# EAGLE design NXTMotorControl2 (EAGLE 7.2.0)
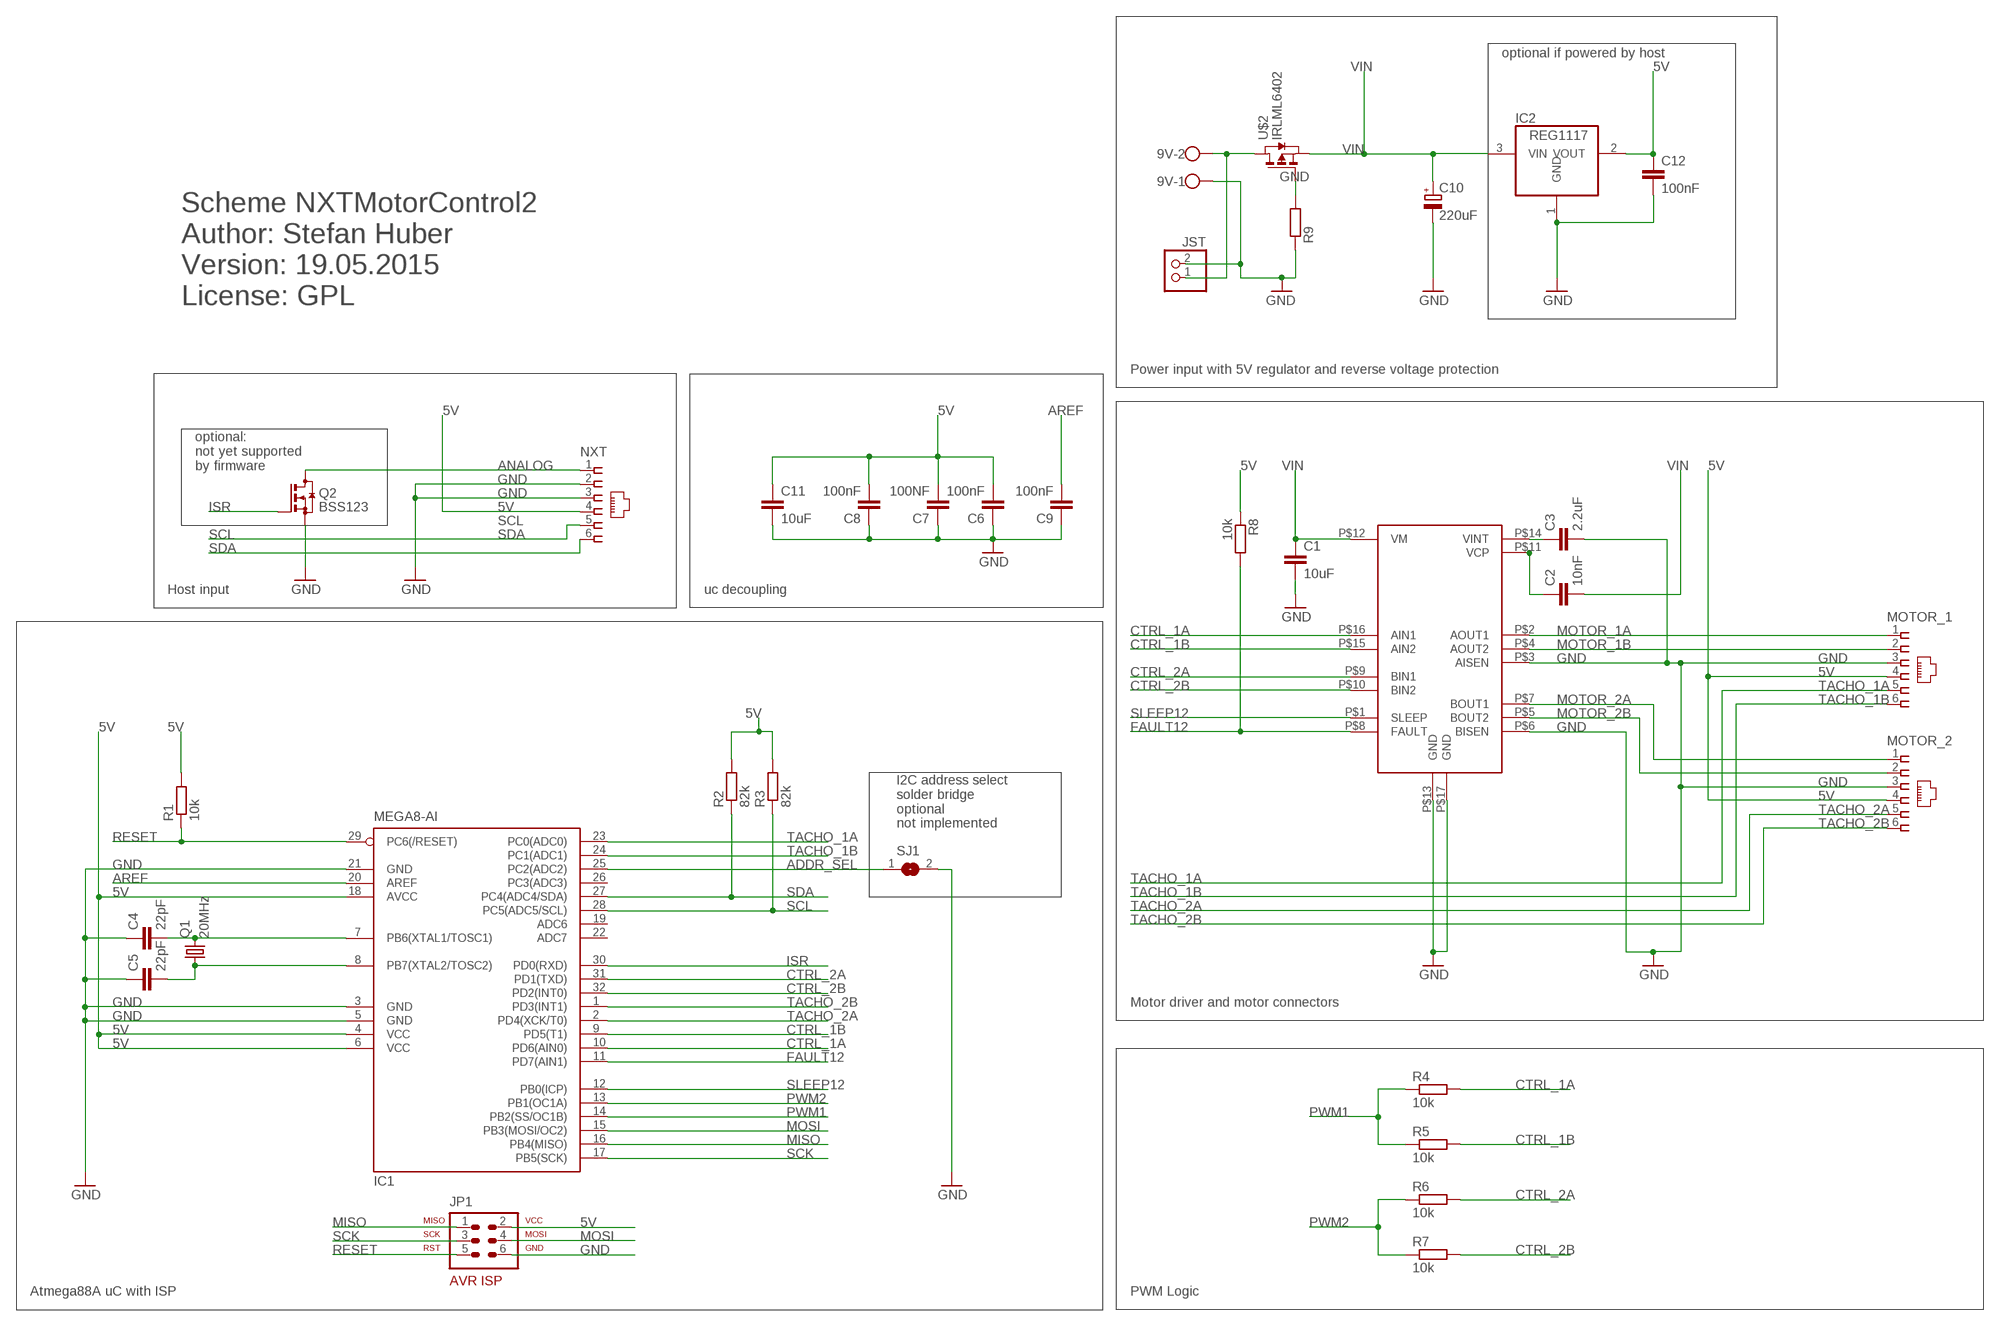
[diagram p0: schematic, sheet 1]

## Parts
9V  W237-102  [W237-102]
C1  10uF  C-EUC0805  [C0805]
C2  10nF  C-EUC0805  [C0805]
C3  2.2uF  C-EUC0805  [C0805]
C4  22pF  C-EUC0805  [C0805]
C5  22pF  C-EUC0805  [C0805]
C6  100nF  C-EUC0805  [C0805]
C7  100NF  C-EUC0805  [C0805]
C8  100nF  C-EUC0805  [C0805]
C9  100nF  C-EUC0805  [C0805]
C10  220uF  CPOL-EUE3.5-8  [E3,5-8]
C11  10uF  C-EUC0805  [C0805]
C12  100nF  C-EUC0805  [C0805]
IC1  MEGA8-AI  [TQFP32-08]
IC2  REG1117  [SOT223]
JP1  ISP  AVR-ISP-6VERT  [AVR-ISP-6]
JST  JST_2PIN-THM  [JST-PH-2-THM]
MOTOR_1  NXT  [NXT]
MOTOR_2  NXT  [NXT]
NXT  NXT  [NXT]
Q1  20MHz  CRYSTALHC49S  [HC49/S]
Q2  BSS123  [SOT23]
R1  10k  R-EU_R0805  [R0805]
R2  82k  R-EU_R0805  [R0805]
R3  82k  R-EU_R0805  [R0805]
R4  10k  R-EU_R0805  [R0805]
R5  10k  R-EU_R0805  [R0805]
R6  10k  R-EU_R0805  [R0805]
R7  10k  R-EU_R0805  [R0805]
R8  10k  R-EU_R0805  [R0805]
R9  R-EU_R0805  [R0805]
SJ1  SJ  [SJ]
U$1  DRV8833  [HTSSOP16]
U$2  IRLML6402  [SOT-23]

## Nets
5V: C6.2 C7.2 C8.2 C11.1 C12.1 IC1.4(VCC) IC1.6(VCC) IC1.18(AVCC) IC2.2(VOUT) JP1.2 MOTOR_1.4 MOTOR_2.4 NXT.4 R1.2 R2.2 R3.2 R8.1
ADDR_SEL: IC1.25(PC2(ADC2)) SJ1.1
ANALOG: NXT.1 Q2.3(D)
AREF: C9.2 IC1.20(AREF)
CTRL_1A: IC1.10(PD6(AIN0)) R4.2 U$1.P$16(AIN1)
CTRL_1B: IC1.9(PD5(T1)) R5.2 U$1.P$15(AIN2)
CTRL_2A: IC1.31(PD1(TXD)) R6.2 U$1.P$9(BIN1)
CTRL_2B: IC1.32(PD2(INT0)) R7.2 U$1.P$10(BIN2)
FAULT12: IC1.11(PD7(AIN1)) R8.2 U$1.P$8(FAULT)
GND: 9V.1 C1.2 C3.2 C4.1 C5.1 C6.1 C7.1 C8.1 C9.1 C10.- C11.2 C12.2 IC1.3(GND) IC1.5(GND) IC1.21(GND) IC2.1(GND) JP1.6 JST.2 MOTOR_1.3 MOTOR_2.3 NXT.2 NXT.3 Q2.2(S) R9.1 SJ1.2 U$1.P$3(AISEN) U$1.P$6(BISEN) U$1.P$13(GND) U$1.P$17(GND)
ISR: IC1.30(PD0(RXD)) Q2.1(G)
MISO: IC1.16(PB4(MISO)) JP1.1
MOSI: IC1.15(PB3(MOSI/OC2)) JP1.4
MOTOR_1A: MOTOR_1.1 U$1.P$2(AOUT1)
MOTOR_1B: MOTOR_1.2 U$1.P$4(AOUT2)
MOTOR_2A: MOTOR_2.1 U$1.P$7(BOUT1)
MOTOR_2B: MOTOR_2.2 U$1.P$5(BOUT2)
N$1: C4.2 IC1.7(PB6(XTAL1/TOSC1)) Q1.2
N$2: C3.1 U$1.P$14(VINT)
N$3: C2.1 U$1.P$11(VCP)
N$4: C5.2 IC1.8(PB7(XTAL2/TOSC2)) Q1.1
N$6: 9V.2 JST.1 U$2.3(D)
N$7: R9.2 U$2.1(G)
PWM1: IC1.14(PB2(SS/OC1B)) R4.1 R5.1
PWM2: IC1.13(PB1(OC1A)) R6.1 R7.1
RESET: IC1.29(PC6(/RESET)) JP1.5 R1.1
SCK: IC1.17(PB5(SCK)) JP1.3
SCL: IC1.28(PC5(ADC5/SCL)) NXT.5 R3.1
SDA: IC1.27(PC4(ADC4/SDA)) NXT.6 R2.1
SLEEP12: IC1.12(PB0(ICP)) U$1.P$1(SLEEP)
TACHO_1A: IC1.23(PC0(ADC0)) MOTOR_1.5
TACHO_1B: IC1.24(PC1(ADC1)) MOTOR_1.6
TACHO_2A: IC1.2(PD4(XCK/T0)) MOTOR_2.5
TACHO_2B: IC1.1(PD3(INT1)) MOTOR_2.6
VIN: C1.1 C2.2 C10.+ IC2.3(VIN) U$1.P$12(VM) U$2.2(S)
Unconnected: IC1.19(ADC6) IC1.22(ADC7) IC1.26(PC3(ADC3))

## Notes on the sheet
- optional if powered by host
- Scheme NXTMotorControl2
  Author: Stefan Huber
  Version: 19.05.2015
  License: GPL
- Power input with 5V regulator and reverse voltage protection
- optional:
  not yet supported
  by firmware
- Host input | uc decoupling
- I2C address select
  solder bridge
  optional
  not implemented
- Motor driver and motor connectors
- Atmega88A uC with ISP | PWM Logic

## Library data of the parts
9V = con-wago-500:W237-102: WAGO SCREW CLAMP; MPN: 237-102; OC_FARNELL: unknown; OC_NEWARK: 70K9898
C1-C3 C12 = rcl:C-EU: CAPACITOR, European symbol
C4-C9 C11 = resistor:C-EU: CAPACITOR, European symbol
C10 = rcl:CPOL-EU: POLARIZED CAPACITOR, European symbol
IC1 = atmel:MEGA8: MICROCONTROLLER 8 Kbytes FLASH, 1 kbytes SRAM, 512 bytes EEPROM, USART, 6-channel 10 bit ADC, 2-channel 8 bit ADC Pin compatible with Atmega48, ATMega88, ATMega168 Source: avr.lbr; MPN: ATMEGA8-16AU; OC_FARNELL: 9171371; OC_NEWARK: 73M8863
IC2 = burr-brown:REG1117: 800mA and 1A Low Dropout (LDO) Positive Regulator 1.8V, 2.5V, 2.85V, 3.3V, 5V, and Adj; MPN: REG1117; OC_FARNELL: 1097566; OC_NEWARK: 14P6981
JP1 = avr-7:AVR-ISP-6: AVR ISP-6 Serial Programming Header
JST = adafruit:JST_2PIN: JST 2-Pin Connectors of various flavors SMT-RA (S2B-PH-SM4) 4UConnector #17311 SMT (B2B-PH-SM4) THM-RA (S2B-PH) THM (B2B-PH)
MOTOR_1 MOTOR_2 NXT = NXT:NXT: 6 Pin RJ-12 Connector for Lego Mindstorms NXT 6/6 Western Telephone Jack
Q1 = crystal:CRYSTAL: CRYSTAL; OC_FARNELL: 1667008; OC_NEWARK: unknown
Q2 = transistor-small-signal:BSS123: N-CHANNEL MOS FET
R1-R9 = rcl:R-EU_: RESISTOR, European symbol
SJ1 = jumper:SJ: SMD solder JUMPER
U$1 = drv8833:DRV8833
U$2 = IRLML6402:IRLML6402

## Board
- 07.03.2015 Removed reverse voltage protection diode; added JST Power connector; removed one of the uC setting solder pads (hidden by NXT connector) - 11.03.2015 Added mosefet reverse voltate protection
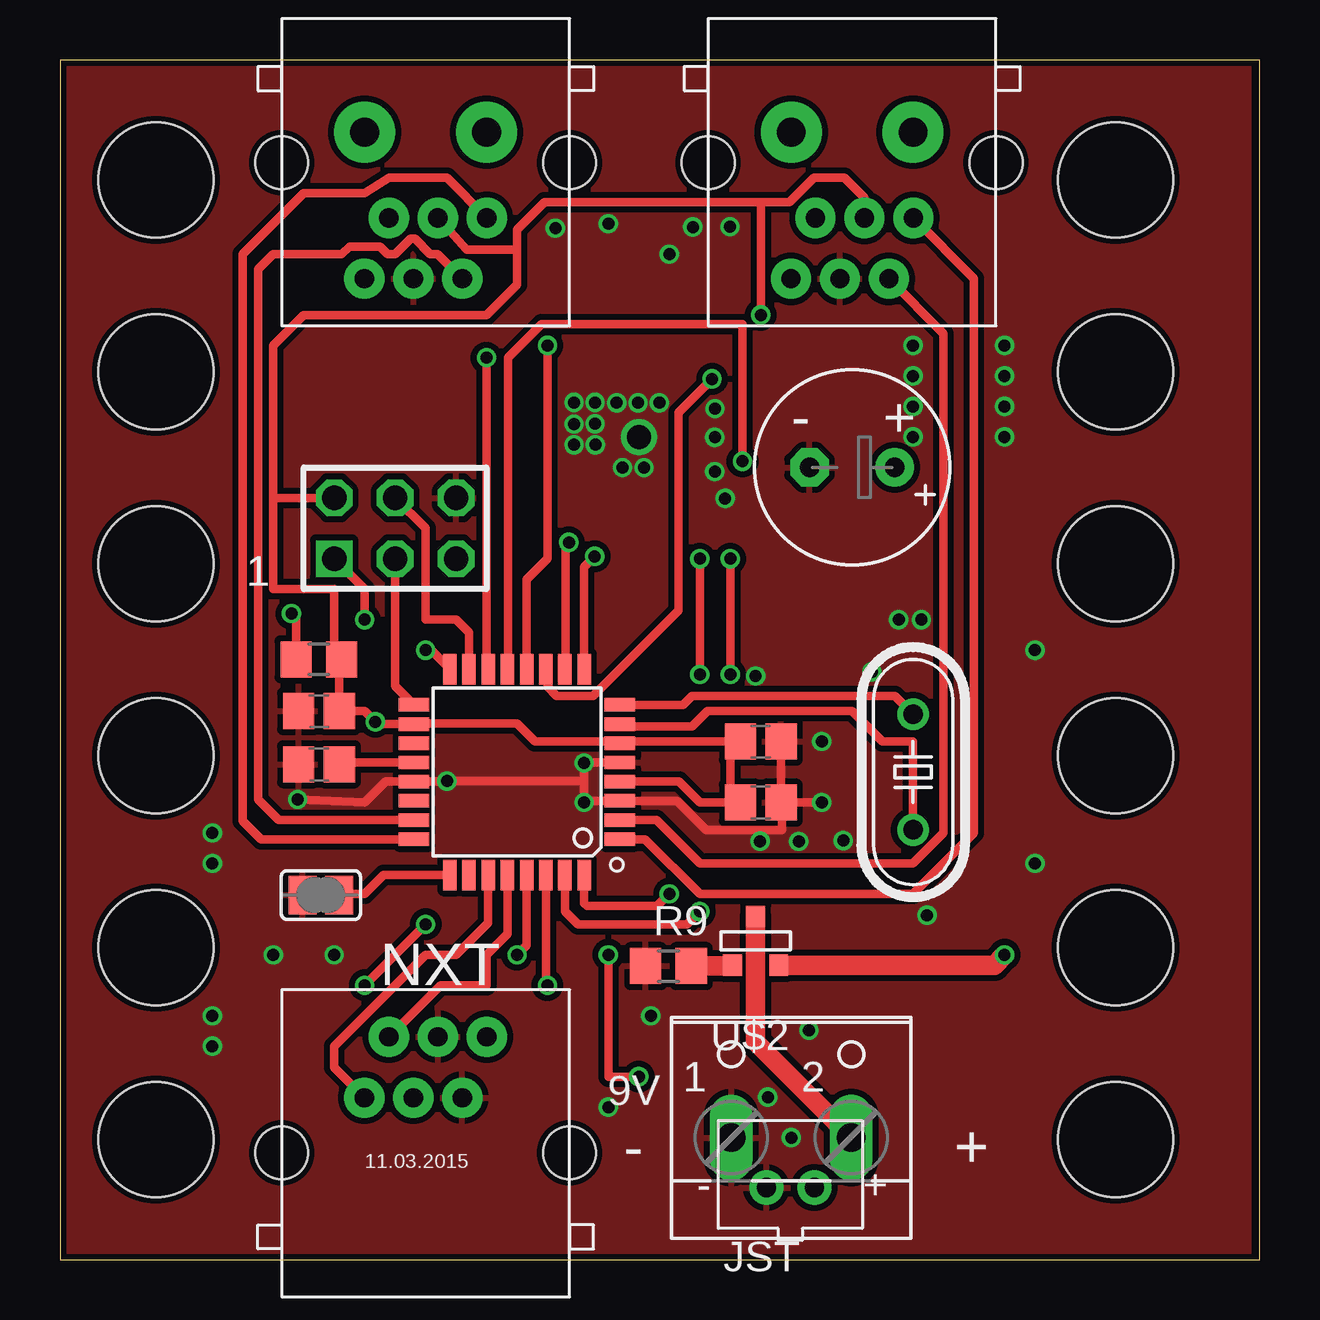
[diagram p1: board, top side]
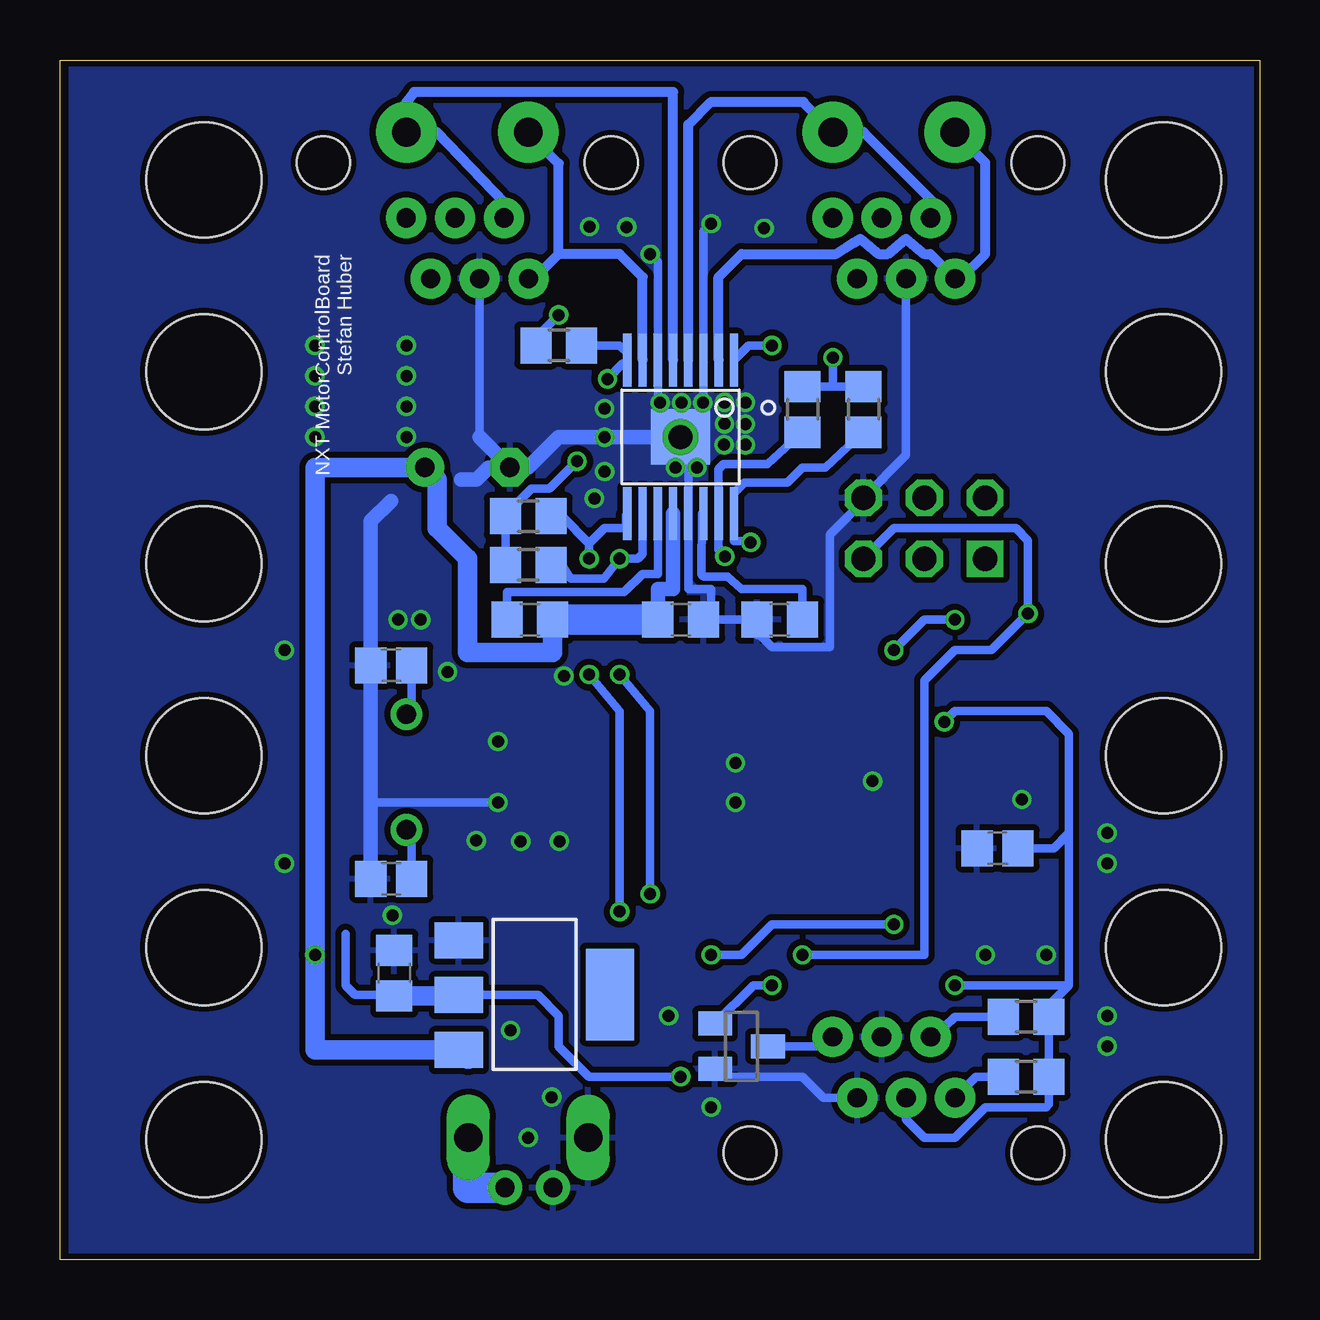
[diagram p2: board, bottom side, seen from below]

Size 50 x 50 mm. Coordinates in mm from the lower left corner, seen from the top.
Outline: 0,0 50,0 50,50 0,50 0,0
Copper layers (1*16): Top 0.035mm / dielectric 1.5mm / Bottom 0.035mm
Design rules "ITEADstudio_DRC": minimum track width 6mil, minimum drill 12mil, track to track 6mil, track to pad 6mil, pad to pad 6mil, via to via 6mil, smd to smd 0mil, copper to edge 10mil, drill to drill 10mil, minimum pad ring 10mil, minimum via ring 6mil, stop-mask expansion 2mil, vias tented up to drill 100mil, thermal gap 10mil
Holes 4.8 mm at 4,5 4,13 4,21 4,29 4,37 4,45 44,45 44,5 44,13 44,21 44,29 44,37

### Footprints (pad centres in the part's own frame; a part is rotated, then mirrored left to right if it is on the bottom)
W237-102 = drill 1.194 long: 1 -2.5,-1.27; 2 2.5,-1.27
C0805 = smd 1.3 x 1.5: 1 -0.95,0; 2 0.95,0
C0805' = smd 1.3 x 1.5: 1 -0.85,0; 2 0.85,0
E3,5-8 = drill 0.813 pad 1.6: + -1.778,0 | drill 0.813 pad 1.6 octagon: - 1.778,0
TQFP32-08 = smd 1.27 x 0.559: 1 -4.293,2.8; 2 -4.293,2; 3 -4.293,1.2; 4 -4.293,0.4; 5 -4.293,-0.4; 6 -4.293,-1.2; 7 -4.293,-2; 8 -4.293,-2.8; 17 4.293,-2.8; 18 4.293,-2; 19 4.293,-1.2; 20 4.293,-0.4; 21 4.293,0.4; 22 4.293,1.2; 23 4.293,2; 24 4.293,2.8 | smd 0.559 x 1.27: 9 -2.8,-4.293; 10 -2,-4.293; 11 -1.2,-4.293; 12 -0.4,-4.293; 13 0.4,-4.293; 14 1.2,-4.293; 15 2,-4.293; 16 2.8,-4.293; 25 2.8,4.293; 26 2,4.293; 27 1.2,4.293; 28 0.4,4.293; 29 -0.4,4.293; 30 -1.2,4.293; 31 -2,4.293; 32 -2.8,4.293
SOT223 = smd 1.499 x 2.007: 1 -2.261,-3.15; 2 0.025,-3.15; 3 2.311,-3.15 | smd 3.81 x 2.007: 4 0,3.15
AVR-ISP-6 = drill 1.016 square: 1 -2.54,-1.27 | drill 1.016 octagon: 2 -2.54,1.27; 3 0,-1.27; 4 0,1.27; 5 2.54,-1.27; 6 2.54,1.27
JST-PH-2-THM = drill 0.8 pad 1.422: 1 1,0; 2 -1,0
NXT = drill 0.8 pad 1.676: 1 2.55,4.84; 2 1.53,2.3; 3 0.51,4.84; 4 -0.51,2.3; 5 -1.53,4.84; 6 -2.55,2.3 | hole 2.2: -6,0; 6,0
HC49/S = drill 0.813: 1 -2.413,0; 2 2.413,0
SOT23 = smd 1 x 1.4: 1 -0.95,-1.1; 2 0.95,-1.1; 3 0,1.1
R0805 = smd 1.3 x 1.5: 1 -0.95,0; 2 0.95,0
SJ = smd 1.168 x 1.6: 1 -0.762,0; 2 0.762,0
HTSSOP16 = smd 0.35 x 2.2: P$1 -2.223,-3.2; P$2 -1.587,-3.2; P$3 -0.953,-3.2; P$4 -0.318,-3.2; P$5 0.318,-3.2; P$6 0.953,-3.2; P$7 1.587,-3.2; P$8 2.223,-3.2; P$9 2.223,3.2; P$10 1.587,3.2; P$11 0.953,3.2; P$12 0.318,3.2; P$13 -0.318,3.2; P$14 -0.953,3.2; P$15 -1.587,3.2; P$16 -2.223,3.2 | smd 2.46 x 2.31: P$17 0,0
SOT-23 = smd 0.787 x 0.889: 1 0.991,1.016; 2 -0.94,1.016; 3 0.025,-1.016

### Placement (x,y rotation side)
9V  30.48,6.35 0 top
C1  24.13,26.67 0 bottom
C2  30.42,26.67 0 bottom
C3  20,26.67 180 bottom
C4  22pF  [C0805']  36.2,15.88 0 bottom
C5  22pF  [C0805']  36.2,24.77 0 bottom
C6  100nF  [C0805']  10.79,22.86 0 top
C7  100NF  [C0805']  29.21,19.05 180 top
C8  100nF  [C0805']  29.21,21.59 180 top
C9  100nF  [C0805']  10.79,20.64 0 top
C10  33.02,33.02 180 top
C11  10uF  [C0805']  10.92,17.14 180 bottom
C12  36.07,11.94 90 bottom
IC1  19.05,20.32 180 top
IC2  30.23,11.05 270 bottom
JP1  13.97,30.48 0 top
JST  30.44,3 0 top
MOTOR_1  15.24,45.72 180 top
MOTOR_2  33.02,45.72 180 top
NXT  15.24,4.45 0 top
Q1  35.56,20.32 270 top
Q2  21.59,8.89 270 bottom
R1  10.79,25.02 0 top
R2  9.73,7.62 0 bottom
R3  9.73,10.12 0 bottom
R4  16.51,35.43 270 bottom
R5  19.05,35.43 270 bottom
R6  30.48,30.99 0 bottom
R7  30.48,28.96 0 bottom
R8  29.21,38.1 0 bottom
R9  25.36,12.23 0 top
SJ1  10.87,15.19 180 top
U$1  24.13,34.29 180 bottom
U$2  29.02,13.28 180 top

### Tracks (layer width: path | path; a pad name or v marks a point on that pad's centre or on a via)
5V  (via drill 0.5)
  Top 0.35: 27.94,19.05 C7.2 | MOTOR_2.4 33.53,44.26 32.7,45.09 31.43,45.09 30.42,44.07 29.21,44.07 | 19.05,42.1 16.94,42.1 MOTOR_1.4 | 8.89,31.75 8.89,27.94 11.43,27.94 11.43,25.33 R1.2 11.64,24.92 C6.2 12.7,22.86 v13.14,22.42 13.24,22.32 IC1.18 14.79,22.35 19.05,22.35 19.81,21.59 23.27,21.59 IC1.6 23.41,21.59 C8.2 27.94,21.17 27.94,19.05 | 8.89,31.75 8.89,38.1 10.16,39.37 17.78,39.37 19.05,40.64 19.05,42.1 | JP1.2 8.89,31.75 | IC1.4 25.8,19.92 26.67,19.05 27.94,19.05 | 19.05,42.1 19.05,42.93 20.19,44.07 29.21,44.07 | v29.21,39.37 29.21,44.07 | v15.24,13.97 v12.7,11.43 | v24.13,7.62 22.86,7.62 v22.86,12.7
  Bottom 0.35: NXT.4 14.73,5.84 13.97,5.08 12.7,5.08 11.43,6.35 8.89,6.35 8.78,6.46 R2.2 R3.2 8.64,10.73 7.94,11.43 | 7.94,11.43 7.94,17.78 | 7.94,17.78 7.94,21.91 8.89,22.86 12.7,22.86 v13.14,22.42 | R8.1 30.16,38.42 v29.21,39.37 | C11.1 8.57,17.14 7.94,17.78 | v22.86,12.7 21.59,12.7 20.32,13.97 v15.24,13.97 | v12.7,11.43 7.94,11.43 | 38.09,13.56 38.1,13.55 38.1,11.43 37.69,11.02 IC2.2 30.07,11.02 29.21,10.16 29.21,8.89 27.94,7.62 v24.13,7.62
  Bottom 0.813: C12.1 33.41,10.99 IC2.2
ADDR_SEL
  Top 0.35: IC1.25 13.49,16.03 12.7,15.24 11.68,15.24 SJ1.1
ANALOG
  Bottom 0.35: Q2.3 18.18,8.89 NXT.1
AREF
  Top 0.35: IC1.20 11.73,20.72 C9.2
CTRL_1A  (via drill 0.5)
  Top 0.35: IC1.10 21.08,24.64 21.08,29.77 v21.21,29.9
  Bottom 0.35: R4.2 18.1,33.02 19.05,33.02 19.68,32.38 21.46,32.38 21.91,31.94 U$1.P$16 21.91,29.95 21.26,29.95 v21.21,29.9
CTRL_1B  (via drill 0.5)
  Top 0.35: IC1.9 21.85,28.87 v22.29,29.31
  Bottom 0.35: R5.2 20.51,33.15 22.35,33.15 22.54,32.96 U$1.P$15 22.54,29.57 v22.29,29.31
CTRL_2A  (via drill 0.5)
  Top 0.35: IC1.31 21.05,14.51 21.59,13.97 26.14,13.97 v26.67,14.5 | v27.94,24.38 v27.94,29.21
  Bottom 0.35: v26.67,14.5 26.67,22.86 v27.94,24.38 | v27.94,29.21 27.94,29.84 | 27.94,29.84 27.3,30.48 26.42,30.48 26.42,31.03 U$1.P$9 | R6.2 29.08,30.99 27.94,29.84
CTRL_2B  (via drill 0.5)
  Top 0.35: v26.67,24.38 v26.67,29.21 | IC1.32 21.85,14.85 21.97,14.73 24.89,14.73 v25.4,15.24
  Bottom 0.35: v25.4,15.24 25.4,22.86 v26.67,24.38 | U$1.P$10 25.72,29.4 25.91,29.21 v26.67,29.21 27.33,28.38 28.73,28.38 29.08,28.96 R7.2
FAULT12  (via drill 0.5)
  Top 0.35: v27.18,36.7 25.78,35.31 25.78,27.05 22.23,23.5 20.7,23.5 20.32,23.88 20.32,24.51 IC1.11
  Bottom 0.35: R8.2 26.67,38.1 26.35,37.78 U$1.P$8 26.42,37.34 26.54,37.34 v27.18,36.7
GND  (via drill 0.5, 1)
  Top 0.35: C8.1 C7.1 | v9.91,19.18 12.7,19.05 13.57,19.92 IC1.21 16.11,19.92 v16.13,19.94 21.84,19.94 | C7.1 v31.75,19.05 | IC1.5 21.86,20.72 v21.84,20.7 21.84,19.94 | C7.1 30.1,19.01 30.1,17.91 26.92,17.91 25.71,19.12 IC1.3 22.16,19.12 v21.84,19.05 21.84,19.94 | 10.1,15.18 SJ1.2
  Bottom 0.35: U$1.P$17 25.08,35.24 U$1.P$6 25.08,41.59 v25.4,41.91 | C3.2 C1.2 22.86,26.99 22.86,27.94 23.81,27.94 U$1.P$13 23.81,33.97 U$1.P$17 | U$1.P$17 23.18,35.24 U$1.P$3 23.18,42.86 v22.86,43.18 | MOTOR_2.3 32.51,34.29 | NXT.2 18.18,6.75 19.05,7.62 22.37,7.62 Q2.2 | v31.75,19.05 37.05,19.05 | C3.2 20.95,26.03 | MOTOR_1.3 14.73,40.77 14.73,33.53 JP1.6 16.51,31.62 17.91,30.23 17.91,25.53 20.32,25.53 20.83,26.04 C3.2
  Bottom 0.61: C4.1 37.05,19.05 C5.1 37.05,30.77 36.2,31.62 | 32.51,34.29 C10.- | U$1.P$17 29.21,34.29 30.48,33.02 C10.- | 33.27,32.51 32.64,32.51 32.13,33.02 C10.-
  other vias: 24.13,34.29 35.9,26.67 36.14,14.35 31.75,21.59 22.86,6.35 40.64,16.51 40.64,25.4 39.37,35.56 39.37,36.83 27.3,35.47 35.56,36.83 35.56,35.56 27.29,34.28 27.29,32.84 22.31,33.96 21.42,33.96 28.99,24.32 33.85,24.5 34.96,26.67 29.18,17.44 30.8,17.42 32.65,17.46 6.35,17.78 6.35,16.51 6.35,10.16 6.35,8.89 22.3,35.73 22.3,34.84 21.42,34.82 21.42,35.73 23.2,35.71 24.09,35.71 24.98,35.71 23.44,33.01 24.35,33.01 11.43,12.7 8.89,12.7 39.37,34.29 35.56,34.29 35.56,38.1 39.37,38.1 27.72,31.72 27.93,43.05 26.38,43.04 20.65,42.99 30.48,5.08 24.63,10.16 31.22,9.55 29.5,6.77
  pour Top (isolate 0.254): 0,50.8 49.53,50.8 49.53,0 0,0
  pour Bottom (isolate 0.254): 0,50.8 49.53,50.8 49.53,0 0,0
ISR  (via drill 0.5)
  Top 0.35: IC1.30 20.25,11.5 v20.32,11.43
  Bottom 0.35: v20.32,11.43 21.1,11.43 Q2.1
MISO  (via drill 0.5)
  Top 0.35: JP1.1 12.7,27.94 v12.7,26.67 | v15.24,25.4 15.46,25.4 IC1.16
  Bottom 0.35: v12.7,26.67 13.97,26.67 v15.24,25.4
MOSI
  Top 0.35: JP1.4 15.24,30.48 15.24,26.67 16.51,26.67 17.05,26.13 IC1.15
MOTOR_1A  (via drill 1.2 pad 2.54)
  Bottom 0.35: MOTOR_1.1 12.46,40.88
  Bottom 0.406: 12.46,40.88 11.43,41.91 11.43,45.72 v12.7,46.99 | U$1.P$2 22.54,40.96 21.59,41.91 17.65,41.91 16.94,42.37 16.64,42.55 15.88,41.91 15.49,41.91 14.73,42.55 13.97,41.91 13.72,41.91 MOTOR_1.1
MOTOR_1B  (via drill 1.2 pad 2.54)
  Bottom 0.35: 13.34,43.81 13.34,43.8 | 19.01,48.26 19.01,48.22
  Bottom 0.406: 13.34,43.81 16.51,46.99 v17.78,46.99 19.01,48.22 | 13.34,43.8 MOTOR_1.2 | U$1.P$4 23.81,47.31 22.86,48.26 19.01,48.26
MOTOR_2A  (via drill 1.2 pad 2.54)
  Bottom 0.406: MOTOR_2.1 30.24,40.88 29.21,41.91 | 29.21,41.91 29.21,45.68 30.48,46.95 v30.48,46.99 | U$1.P$7 25.72,40.96 26.67,41.91 29.21,41.91
MOTOR_2B  (via drill 1.2 pad 2.54)
  Bottom 0.406: MOTOR_2.2 31.47,43.78 31.47,44.06 34.29,46.99 v35.56,46.99 35.56,48.26 35.24,48.67 24.45,48.67 U$1.P$5
N$1
  Top 0.35: IC1.7 23.44,22.23 26.35,22.23 26.99,22.86 33.02,22.86 34.29,21.59 35.56,21.59 Q1.2
  Bottom 0.35: C4.2 35.34,17.69 Q1.2
N$2
  Bottom 0.35: C3.1 19.05,27.94 21.59,27.94 22.19,28.47 23.15,28.47 arc90 23.25,28.57 23.24,31.09 U$1.P$14
N$3
  Bottom 0.35: U$1.P$11 25.08,28.57 25.72,28.57 26.48,27.81 31.37,27.81 C2.1
N$4
  Top 0.35: 35.17,23.12 Q1.1 34.8,23.5 26.35,23.5 25.98,23.12 IC1.8
  Bottom 0.35: C5.2 35.34,22.95 Q1.1
N$6
  Top 0.813: U$2.3 28.99,9.07 9V.2 32.83,5.08
  Bottom 1.27: JST.1 32.98,3 9V.2
N$7
  Top 0.813: R9.2 28,12.24 U$2.1
PWM1  (via drill 0.5)
  Top 0.35: v17.78,37.59 17.78,24.64 IC1.14
  Bottom 0.35: R5.1 17.78,36.38 | 17.78,36.38 R4.1 | 17.78,36.38 v17.78,37.59
PWM2  (via drill 0.5)
  Top 0.35: v28.45,33.27 28.45,38.99 20.07,38.99 18.67,37.59 18.67,24.64 IC1.13
  Bottom 0.35: R7.1 R6.1 31.37,31.11 30.35,32.13 29.59,32.13 v28.45,33.27
RESET  (via drill 0.5)
  Top 0.35: R1.1 9.85,26.73 v9.65,26.92 | IC1.29 19.45,13.1 v19.05,12.7
  Bottom 0.35: JP1.5 15.24,30.48 10.16,30.48 9.65,29.97 v9.65,26.92 11.18,25.4 12.7,25.4 13.97,24.13 13.97,12.7 v19.05,12.7
SCK
  Top 0.35: JP1.3 13.97,23.91 IC1.17
SCL
  Top 0.35: IC1.28 18.65,13.57 17.78,12.7 17.78,11.43 15.86,11.43 NXT.5
  Bottom 0.35: NXT.5 13.57,9.29 12.7,10.11 R3.1
SDA
  Top 0.35: IC1.27 17.85,14.04 16.51,12.7 15.24,12.7 11.43,8.89 11.43,8.01 NXT.6
  Bottom 0.35: R2.1 11.81,7.62 NXT.6
SLEEP12  (via drill 0.5)
  Top 0.35: IC1.12 19.45,28.34 20.32,29.21 v20.32,38.1
  Bottom 0.35: v20.32,38.1 21.3,38.1 U$1.P$1
TACHO_1A
  Top 0.35: MOTOR_1.5 15.74,41.91 15.43,41.91 14.8,42.55 14.61,42.55 13.97,41.91 13.65,41.91 13.34,42.23 12.06,42.23 11.75,41.91 8.89,41.91 8.26,41.27 8.26,19.18 9.11,18.32 IC1.23
TACHO_1B
  Top 0.35: MOTOR_1.6 16.12,45.09 13.72,45.09 12.7,44.45 10.16,44.45 7.62,41.91 7.62,18.29 8.39,17.52 IC1.24
TACHO_2A
  Top 0.35: IC1.2 24.86,18.32 26.67,16.51 35.56,16.51 36.83,17.78 36.83,38.6 MOTOR_2.5
TACHO_2B
  Top 0.35: IC1.1 24.39,17.52 26.67,15.24 35.56,15.24 38.1,17.78 38.1,40.89 MOTOR_2.6
VIN  (via drill 0.5)
  Top 0.813: U$2.2 38.94,12.27 v39.37,12.7
  Bottom 0.35: 25.4,26.99 C1.1
  Bottom 0.61: U$1.P$12 24.45,27.94 25.08,27.94 C1.1 | 29.47,25.4 29.46,25.3
  Bottom 0.813: C2.2 29.47,25.4 | 29.46,25.3 33.02,25.3 33.02,29.21 34.29,30.48 34.29,32.51 C10.+ 39.37,33.02 v39.37,12.7 39.37,8.89 | 39.37,8.74 39.37,8.89 | IC2.3 39.37,8.74 | 39.37,8.74 39.36,8.75 | 32.98,8.34 IC2.3 | IC2.3 39.22,8.74 39.37,8.89
  Bottom 1.27: C2.2 C1.1

### Text on the board
tNames: - | + | 1 | ° | 11.03.2015 | - | +
bNames: NXT MotorControlBoard / Stefan Huber | °